# Altium schematic sheet BinaryClock_Control.SchDoc
size 594 x 420 mm; Scale: 1:1; Разраб.: Яковлев; Общее количество листов: 2; Наименование изделия 1: Бинарные часы; Наименование изделия 2: Схема электрическая; Наименование изделия 3: принципиальная
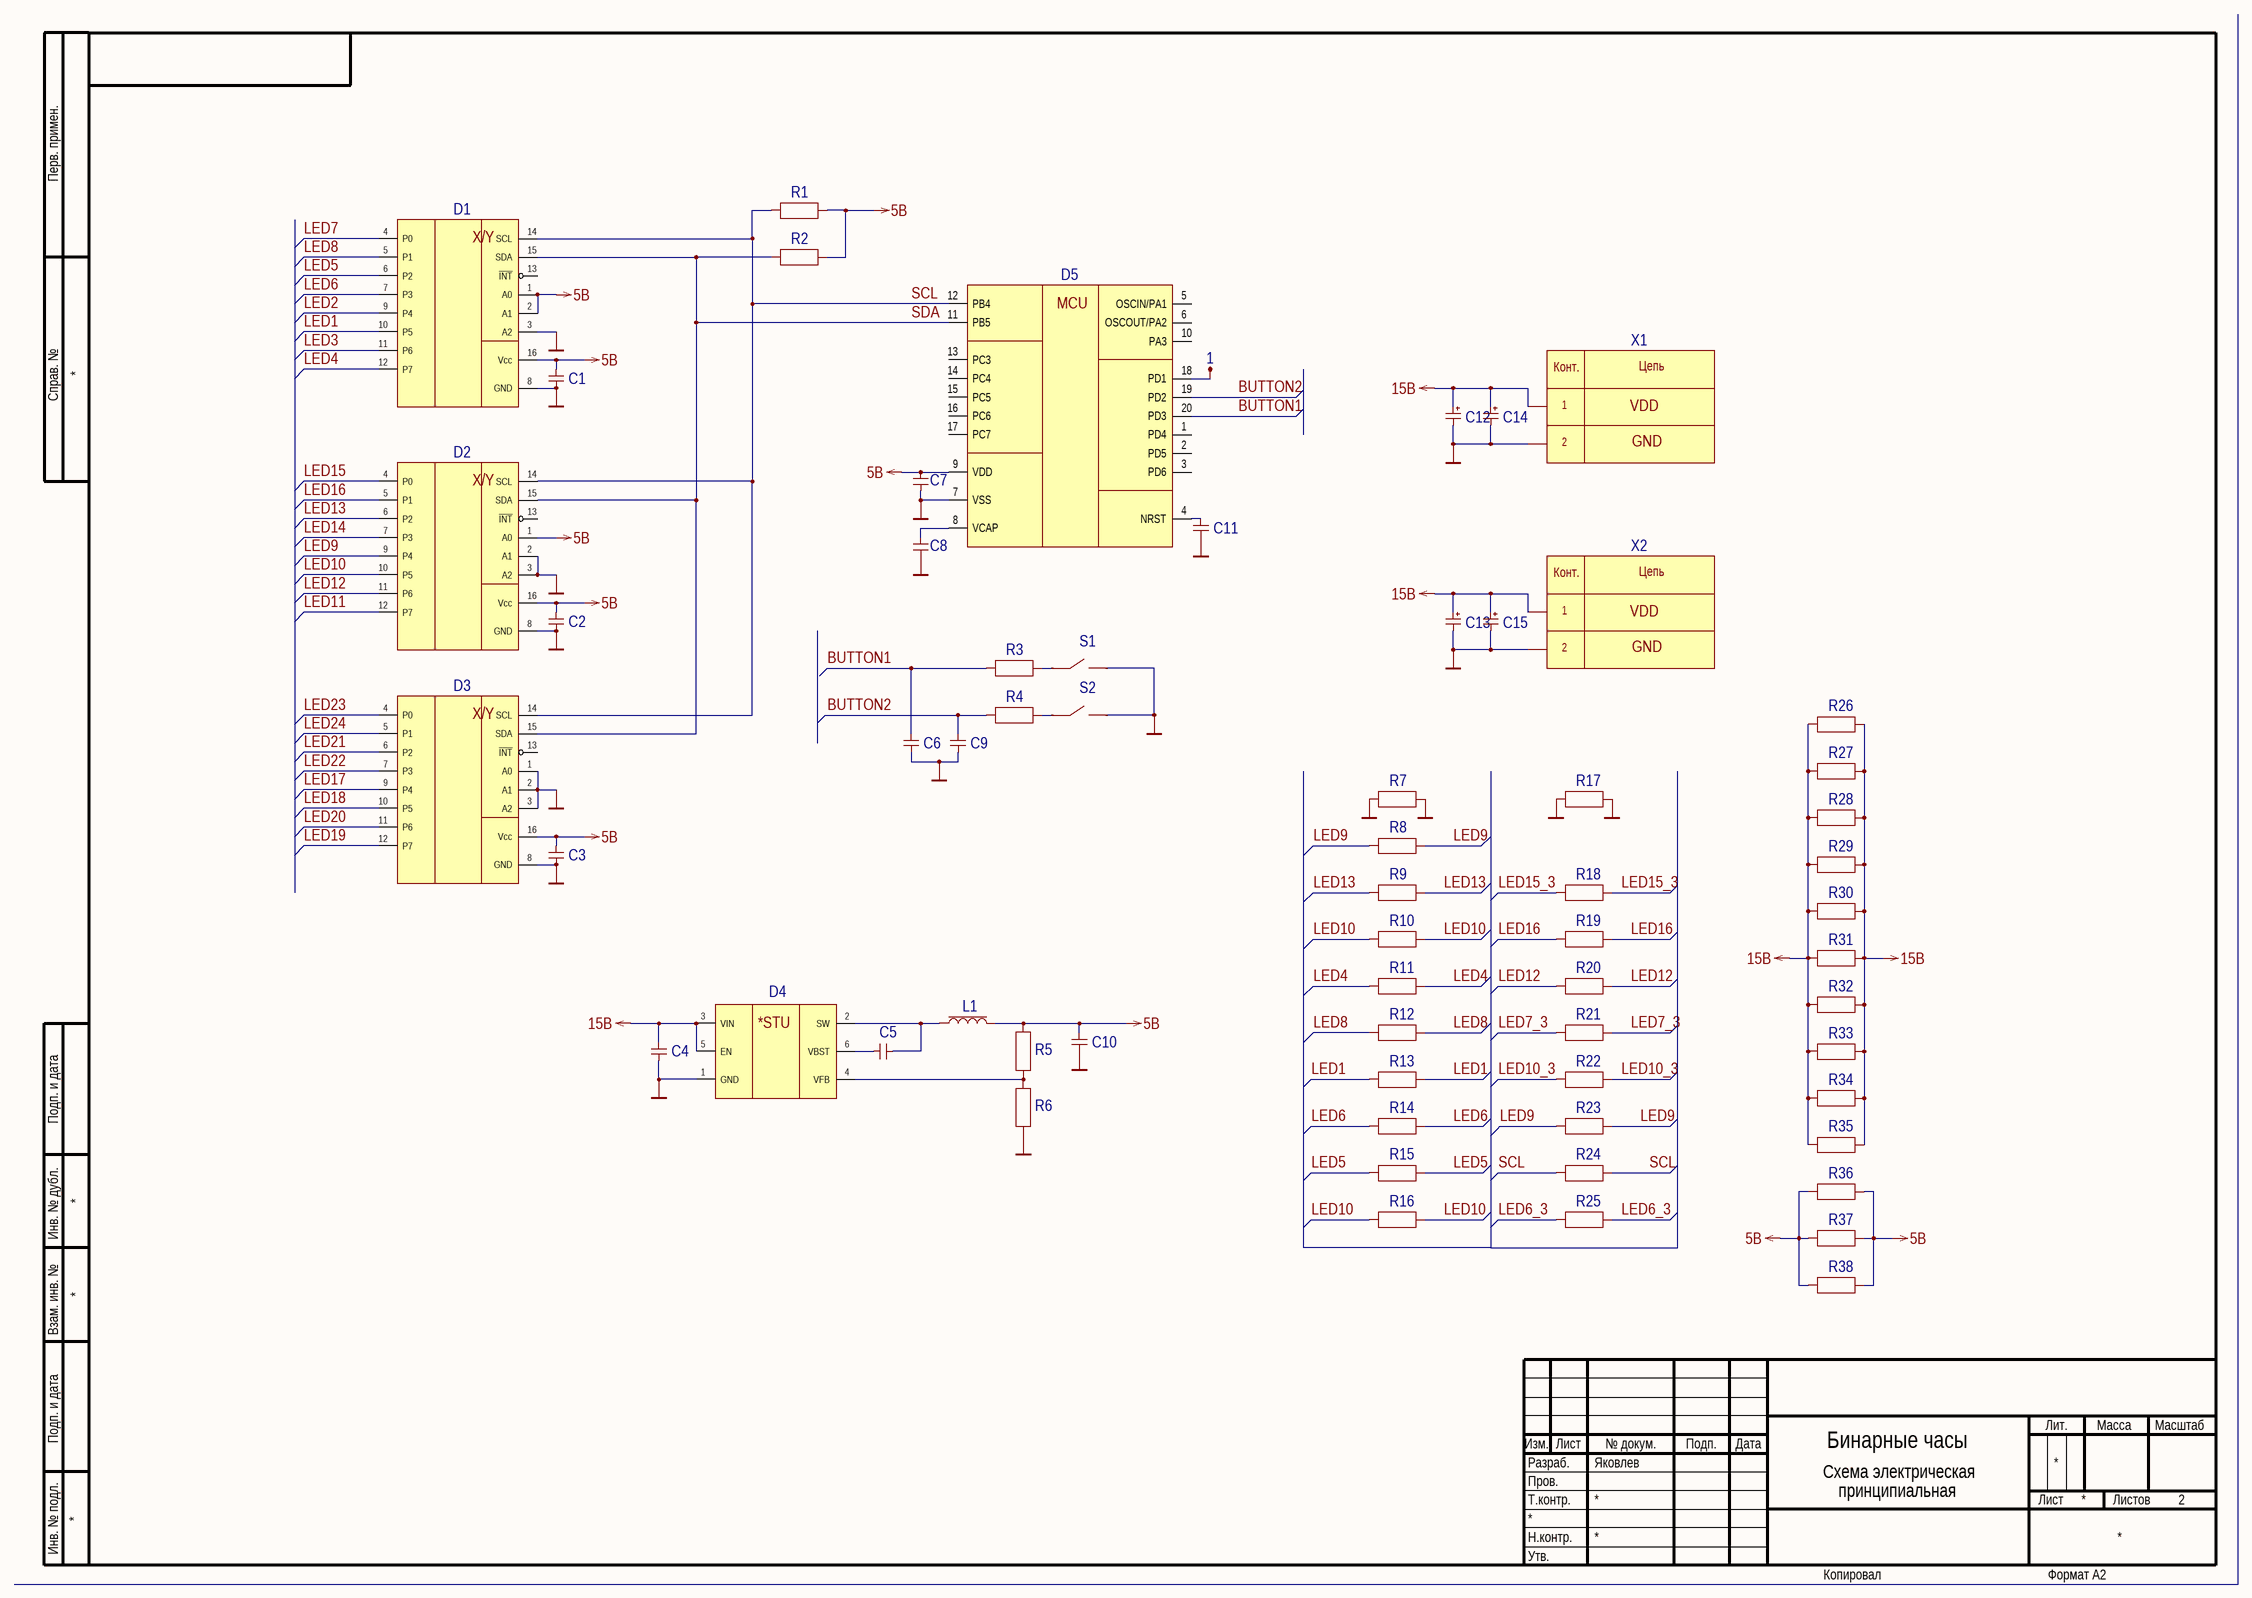
[diagram p0: BinaryClock_Control.SchDoc]

## Parts
1  Point  [point]  (value not drawn)
C1  0805-16 В-X7R-0,1мкФ±10 %  [SMD-0805C]  (value not drawn)
C2  0805-16 В-X7R-0,1мкФ±10 %  [SMD-0805C]  (value not drawn)
C3  0805-16 В-X7R-0,1мкФ±10 %  [SMD-0805C]  (value not drawn)
C4  1206-16 В-X7R-22мкФ±10 %  [SMD-1206C]  (value not drawn)
C5  0805-16 В-X7R-0,1мкФ±10 %  [SMD-0805C]  (value not drawn)
C6  0805-16 В-X7R-0,1мкФ±10 %  [SMD-0805C]  (value not drawn)
C7  0805-16 В-X7R-0,1мкФ±10 %  [SMD-0805C]  (value not drawn)
C8  0805-16 В-X7R-1мкФ±10 %  [SMD-0805C]  (value not drawn)
C9  0805-16 В-X7R-0,1мкФ±10 %  [SMD-0805C]  (value not drawn)
C10  1206-16 В-X7R-22мкФ±10 %  [SMD-1206C]  (value not drawn)
C11  0805-16 В-X7R-0,1мкФ±10 %  [SMD-0805C]  (value not drawn)
C12  D-20 В-47 мкФ±10 %  [CAP POL 2917/7343]  (value not drawn)
C13  D-20 В-47 мкФ±10 %  [CAP POL 2917/7343]  (value not drawn)
C14  D-20 В-47 мкФ±10 %  [CAP POL 2917/7343]  (value not drawn)
C15  D-20 В-47 мкФ±10 %  [CAP POL 2917/7343]  (value not drawn)
D1  PCF8574T/3.512  [SO-16]  (value not drawn)
D2  PCF8574T/3.512  [SO-16]  (value not drawn)
D3  PCF8574T/3.512  [SO-16]  (value not drawn)
D4  TPS562200DDCT  [SOT23-6_M]  (value not drawn)
D5  STM8S103F3P6  [TSSOP-20]  (value not drawn)
L1  NLCV32T-4R7M-EF  [1210_M]  (value not drawn)
R1  0805±5 %-10 кОм  [SMD-0805-RES]  (value not drawn)
R2  0805±5 %-10 кОм  [SMD-0805-RES]  (value not drawn)
R3  0805±5 %-100 Ом  [SMD-0805-RES]  (value not drawn)
R4  0805±5 %-100 Ом  [SMD-0805-RES]  (value not drawn)
R5  0805±1 %-56,2 кОм  [SMD-0805-RES]  (value not drawn)
R6  0805±1 %-10,2 кОм  [SMD-0805-RES]  (value not drawn)
R7  0805±5 %-0 Ом  [R1206]  (value not drawn)
R8  0805±5 %-0 Ом  [R1206]  (value not drawn)
R9  0805±5 %-0 Ом  [R1206]  (value not drawn)
R10  0805±5 %-0 Ом  [R1206]  (value not drawn)
R11  0805±5 %-0 Ом  [R1206]  (value not drawn)
R12  0805±5 %-0 Ом  [R1206]  (value not drawn)
R13  0805±5 %-0 Ом  [R1206]  (value not drawn)
R14  0805±5 %-0 Ом  [R1206]  (value not drawn)
R15  0805±5 %-0 Ом  [R1206]  (value not drawn)
R16  0805±5 %-0 Ом  [R1206]  (value not drawn)
R17  0805±5 %-0 Ом  [R1206]  (value not drawn)
R18  0805±5 %-0 Ом  [R1206]  (value not drawn)
R19  0805±5 %-0 Ом  [R1206]  (value not drawn)
R20  0805±5 %-0 Ом  [R1206]  (value not drawn)
R21  0805±5 %-0 Ом  [R1206]  (value not drawn)
R22  0805±5 %-0 Ом  [R1206]  (value not drawn)
R23  0805±5 %-0 Ом  [R1206]  (value not drawn)
R24  0805±5 %-0 Ом  [R1206]  (value not drawn)
R25  0805±5 %-0 Ом  [R1206]  (value not drawn)
R26  0805±5 %-0 Ом  [R1206]  (value not drawn)
R27  0805±5 %-0 Ом  [R1206]  (value not drawn)
R28  0805±5 %-0 Ом  [R1206]  (value not drawn)
R29  0805±5 %-0 Ом  [R1206]  (value not drawn)
R30  0805±5 %-0 Ом  [R1206]  (value not drawn)
R31  0805±5 %-0 Ом  [R1206]  (value not drawn)
R32  0805±5 %-0 Ом  [R1206]  (value not drawn)
R33  0805±5 %-0 Ом  [R1206]  (value not drawn)
R34  0805±5 %-0 Ом  [R1206]  (value not drawn)
R35  0805±5 %-0 Ом  [R1206]  (value not drawn)
R36  0805±5 %-0 Ом  [R1206]  (value not drawn)
R37  0805±5 %-0 Ом  [R1206]  (value not drawn)
R38  0805±5 %-0 Ом  [R1206]  (value not drawn)
S1  1243SHIM-160G-G  [1243S]  (value not drawn)
S2  1243SHIM-160G-G  [1243S]  (value not drawn)
X1  RASM712X  [RASM712]  (value not drawn)
X2  RASM712X  [RASM712]  (value not drawn)

## Nets
5В: C1.2 C2.2 C3.2 C7.2 C10.2 D1.1(A0) D1.2(A1) D1.16(Vcc) D2.1(A0) D2.16(Vcc) D3.16(Vcc) D5.9(VDD) L1.2 R1.2 R2.2 R5.2 R36.1 R36.2 R37.1 R37.2 R38.1 R38.2
15В: C4.2 C12.1 C13.1 C14.1 C15.1 D4.3(VIN) D4.5(EN) R26.1 R26.2 R27.1 R27.2 R28.1 R28.2 R29.1 R29.2 R30.1 R30.2 R31.1 R31.2 R32.1 R32.2 R33.1 R33.2 R34.1 R34.2 R35.1 R35.2 X1.1 X2.1
GND: C1.1 C2.1 C3.1 C4.1 C6.1 C7.1 C8.1 C9.1 C10.1 C11.1 C12.2 C13.2 C14.2 C15.2 D1.3(A2) D1.8(GND) D2.2(A1) D2.3(A2) D2.8(GND) D3.1(A0) D3.2(A1) D3.3(A2) D3.8(GND) D4.1(GND) D5.7(VSS) R6.1 R7.1 R7.2 R17.1 R17.2 S1.2 S2.2 X1.2 X2.2
BUTTON1: C6.2 D5.20(PD3) R3.1
BUTTON2: C9.2 D5.19(PD2) R4.1
LED1: D1.10(P5) R13.1 R13.2
LED2: D1.9(P4)
LED3: D1.11(P6)
LED4: D1.12(P7) R11.1 R11.2
LED5: D1.6(P2) R15.1 R15.2
LED6: D1.7(P3) R14.1 R14.2
LED6_3: R25.1 R25.2
LED7: D1.4(P0)
LED7_3: R21.1 R21.2
LED8: D1.5(P1) R12.1 R12.2
LED9: D2.9(P4) R8.1 R8.2 R23.1 R23.2
LED10: D2.10(P5) R10.1 R10.2 R16.1 R16.2
LED10_3: R22.1 R22.2
LED11: D2.12(P7)
LED12: D2.11(P6) R20.1 R20.2
LED13: D2.6(P2) R9.1 R9.2
LED14: D2.7(P3)
LED15: D2.4(P0)
LED15_3: R18.1 R18.2
LED16: D2.5(P1) R19.1 R19.2
LED17: D3.9(P4)
LED18: D3.10(P5)
LED19: D3.12(P7)
LED20: D3.11(P6)
LED21: D3.6(P2)
LED22: D3.7(P3)
LED23: D3.4(P0)
LED24: D3.5(P1)
SCL: D1.14(SCL) D2.14(SCL) D3.14(SCL) D5.12(PB4) R1.1 R24.1 R24.2
SDA: D1.15(SDA) D2.15(SDA) D3.15(SDA) D5.11(PB5) R2.1
Net1_1: 1.1 D5.18(PD1)
NetC5_1: C5.1 D4.2(SW) L1.1
NetC5_2: C5.2 D4.6(VBST)
NetC8_2: C8.2 D5.8(VCAP)
NetC11_2: C11.2 D5.4(NRST)
NetD4_4: D4.4(VFB) R5.1 R6.2
NetR3_2: R3.2 S1.1
NetR4_2: R4.2 S2.1

Not connected (* = marked no-connect by the designer): D1 13(~{INT}); D2 13(~{INT}); D3 13(~{INT}); D5 1(PD4) 2(PD5) 3(PD6) 5(OSCIN/PA1) 6(OSCOUT/PA2) 10(PA3) 13(PC3) 14(PC4) 15(PC5) 16(PC6) 17(PC7)

## Notes on the sheet
- VDD
- GND
- Перв. примен.
- Справ. №
- Подп. и дата
- Инв. № дубл.
- Взам. инв. №
- Разраб.
- Изм.
- Лист
- № докум.
- Подп.
- Дата
- Лит.
- Масса
- Масштаб
- Пров.
- Т.контр.
- Листов
- Инв. № подл.
- Утв.
- Н.контр.
- Копировал
- Формат А2
- (in symbol PCF8574) X/Y
- (in symbol RASM712X) Цепь; Конт.
- (in symbol STM8S103FxP) MCU
- (in symbol TPS562200) *STU

## Library data of the parts
C1-C3 C5-C7 C9 C11 = Cap: Capacitor; Manufacturer: Murata; Value: 0,1 мкФ; ComponentLink1Description: Datasheet
C4 C10 = Cap: Capacitor; Value: 22 мкФ; Manufacturer: *; ComponentLink1Description: Datasheet
C8 = Cap: Capacitor; Manufacturer: Murata; Value: 1 мкФ; ComponentLink1Description: Datasheet
C12-C15 = Cap_el: Electrolytic capacitor; Value: 47 мкФ; Manufacturer: *; ComponentLink1Description: Datasheet
D1-D3 = PCF8574: Remote 8-bit I/O expander for I2C bus; Manufacturer: NXP; ComponentLink1Description: Datasheet; ComponentLink1URL: https://www.nxp.com/docs/en/data-sheet/PCF8574_PCF8574A.pdf
D4 = TPS562200: 4.5-V To 17-V Input, 2-A, 3-A Synchronous Step-Down Voltage Regulator; Manufacturer: Texas Instruments; ComponentLink1Description: Datasheet; ComponentLink1URL: http://www.ti.com/lit/ds/symlink/tps562200.pdf
D5 = STM8S103FxP: Access line, 16 MHz STM8S 8-bit MCU, up to 8 Kbytes Flash,   data EEPROM,10-bit ADC, 3 timers, UART, SPI, I²C; Manufacturer: STMicroelectronics; ComponentLink1Description: Datasheet; ComponentLink1URL: http://www.st.com/content/ccc/resource/technical/document/datasheet/ce/13/13/03/a9/a4/42/8f/CD00226640.pdf/files/CD00226640.pdf/jcr:content/translations/en.CD00226640.pdf
L1 = Inductor: Manufacturer: TDK; Value: 4,7 мкГн; ComponentLink1Description: Datasheet; ComponentLink1URL: https://product.tdk.com/info/en/catalog/datasheets/inductor_commercial_decoupling_nlcv32-ef_en.pdf
R1 R2 = Res: Resistor; Value: 10 кОм; ComponentLink1Description: Datasheet
  R1: Manufacturer: *
R3 R4 = Res: Resistor; Value: 100 Ом; Manufacturer: *; ComponentLink1Description: Datasheet
R5 R6 = Res: Resistor; Manufacturer: *; ComponentLink1Description: Datasheet
  R5: Value: 56,2 кОм
  R6: Value: 10,2 кОм
R7-R38 = Res: Resistor; Value: 0 Ом; Manufacturer: *; ComponentLink1Description: Datasheet
S1 S2 = button: Tact button SPST; Manufacturer: Switronic; ComponentLink1Description: Datasheet; ComponentLink1URL: http://www.voltmaster.ru/pdf/datasheets/switronic/Cata_A09.gif
X1 X2 = RASM712X: Power jack 2.5 mm SMD connector; Manufacturer: Switchcraft; ComponentLink1Description: Datasheet; ComponentLink1URL: http://www.farnell.com/cad/526481.pdf